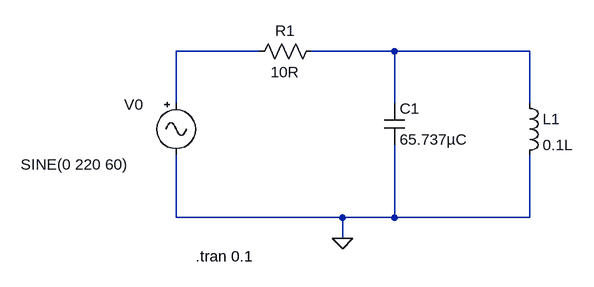
[diagram p0: schematic Circuito_com_capacitor.asc]
Circuito_com_capacitor.asc, the LTspice schematic file:
Version 4
SHEET 1 880 680
WIRE 64 64 -64 64
WIRE 272 64 144 64
WIRE 480 64 272 64
WIRE -64 144 -64 64
WIRE 272 144 272 64
WIRE 480 144 480 64
WIRE -64 320 -64 224
WIRE 192 320 -64 320
WIRE 272 320 272 208
WIRE 272 320 192 320
WIRE 480 320 480 224
WIRE 480 320 272 320
WIRE 192 352 192 320
FLAG 192 352 0
SYMBOL Misc\\signal -64 128 R0
WINDOW 0 -80 18 Left 2
WINDOW 3 -239 110 Left 2
WINDOW 123 0 0 Left 0
WINDOW 39 0 0 Left 0
SYMATTR InstName V0
SYMATTR Value SINE(0 220 60)
SYMBOL res 160 48 R90
WINDOW 0 0 56 VBottom 2
WINDOW 3 32 56 VTop 2
SYMATTR InstName R1
SYMATTR Value 10R
SYMBOL ind 464 128 R0
SYMATTR InstName L1
SYMATTR Value 0.1L
SYMBOL cap 256 144 R0
SYMATTR InstName C1
SYMATTR Value 65.737µC
TEXT -34 380 Left 2 !.tran 0.1

The netlist it stands for:
* Circuito_com_capacitor.asc
V0 N001 0 SINE(0 220 60)
R1 N002 N001 10R
L1 N002 0 0.1L
C1 N002 0 65.737µC
.tran 0.1
.backanno
.end